# EAGLE design USB DigiVOX Interface V5 (EAGLE 9.6.1)
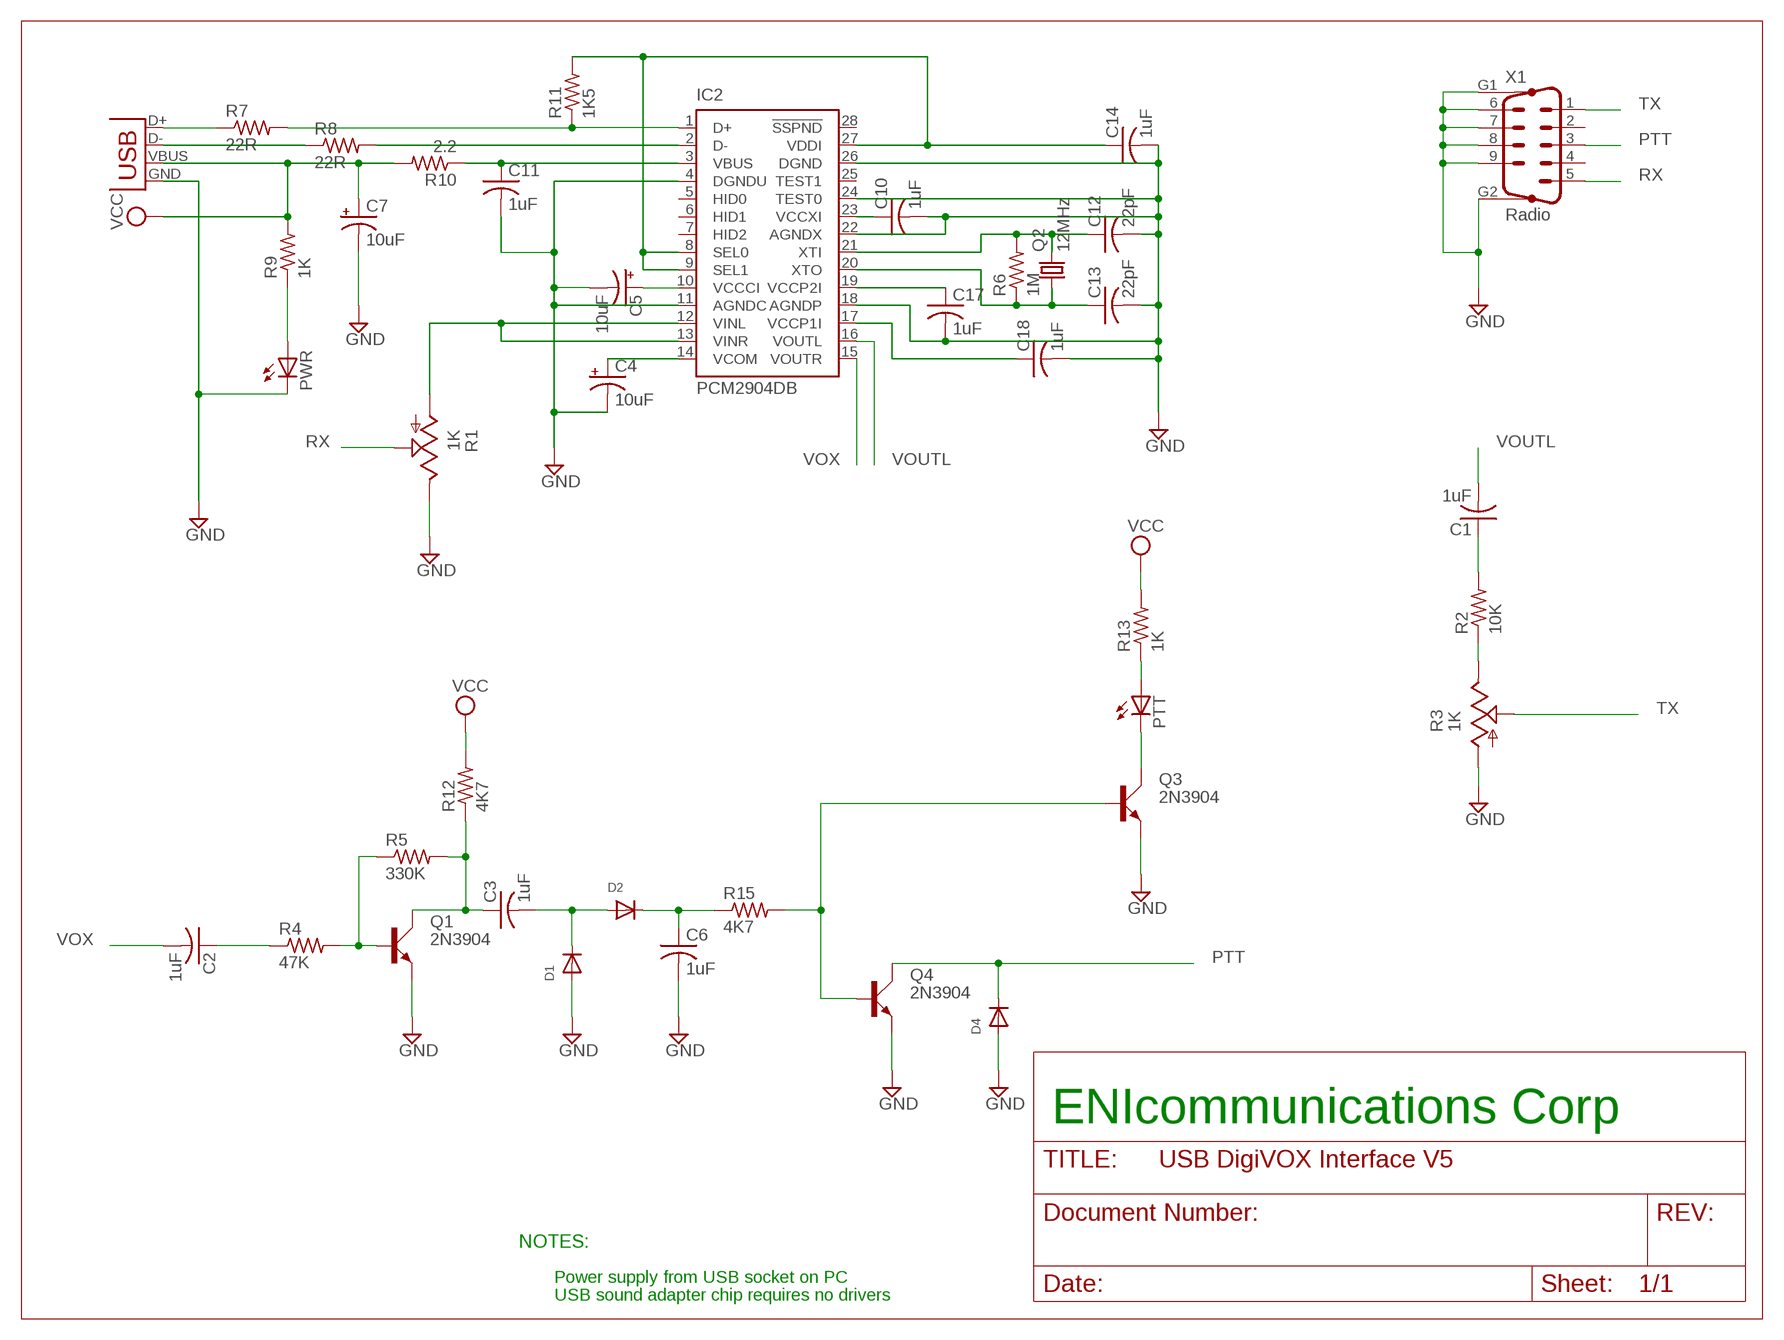
[diagram p0: schematic, sheet 1]

## Parts
C1  1uF  C-US025-025X050  [C025-025X050]
C2  1uF  C-US025-025X050  [C025-025X050]
C3  1uF  C-US025-025X050  [C025-025X050]
C4  10uF  CAP_POLPTH2  [CPOL-RADIAL-10UF-25V]
C5  10uF  CAP_POLPTH2  [CPOL-RADIAL-10UF-25V]
C6  1uF  C-US025-025X050  [C025-025X050]
C7  10uF  CAP_POLPTH2  [CPOL-RADIAL-10UF-25V]
C10  1uF  C-US025-025X050  [C025-025X050]
C11  1uF  C-US025-025X050  [C025-025X050]
C12  22pF  C-US025-025X050  [C025-025X050]
C13  22pF  C-US025-025X050  [C025-025X050]
C14  1uF  C-US025-025X050  [C025-025X050]
C17  1uF  C-US025-025X050  [C025-025X050]
C18  1uF  C-US025-025X050  [C025-025X050]
D1  DIODEDO-1N4148  [DO-1N4148]
D2  DIODEDO-1N4148  [DO-1N4148]
D4  DIODEDO-1N4148  [DO-1N4148]
IC2  PCM2904DB  [SSOP28DB]
PTT  LED3MM  [LED3MM]
PWR  LED3MM  [LED3MM]
Q1  2N3904  [TO92D]
Q2  12MHz  CRYSTALHC49S  [HC49/S]
Q3  2N3904  [TO92D]
Q4  2N3904  [TO92D]
R1  1K  TRIM_US-CA6V  [CA6V]
R2  10K  R-US_0204/7  [0204/7]
R3  1K  TRIM_US-CA6V  [CA6V]
R4  47K  R-US_0207/2V  [0207/2V]
R5  330K  R-US_0207/2V  [0207/2V]
R6  1M  R-US_0207/2V  [0207/2V]
R7  22R  R-US_0207/2V  [0207/2V]
R8  22R  R-US_0207/2V  [0207/2V]
R9  1K  R-US_0207/2V  [0207/2V]
R10  2.2  R-US_0207/2V  [0207/2V]
R11  1K5  R-US_0207/2V  [0207/2V]
R12  4K7  R-US_0207/2V  [0207/2V]
R13  1K  R-US_0204/7  [0204/7]
R15  4K7  R-US_0207/2V  [0207/2V]
X1  Radio  M09HP  [M09HP]
X2  USBSMD  [USB-MINIB]

## Nets
GND: C4.2(-) C5.2(-) C6.2 C7.2(-) C10.2 C11.2 C12.2 C13.2 C14.2 C17.2 C18.2 D1.A D4.A IC2.4(DGNDU) IC2.11(AGNDC) IC2.18(AGNDP) IC2.22(AGNDX) IC2.24(TEST0) IC2.26(DGND) PWR.K(C) Q1.E Q3.E Q4.E R1.E R3.A X1.6 X1.7 X1.8 X1.9 X1.G1 X1.G2 X2.GND
N$1: C1.1 R2.2
N$2: R2.1 R3.E
N$3: C5.1(+) IC2.10(VCCCI)
N$4: C12.1 IC2.21(XTI) Q2.2 R6.2
N$5: PWR.A R9.1
N$6: C13.1 IC2.20(XTO) Q2.1 R6.1
N$7: C10.1 IC2.23(VCCXI)
N$8: C2.1 R4.1
N$9: C4.1(+) IC2.14(VCOM)
N$10: Q1.B R4.2 R5.1
N$11: C3.1 Q1.C R5.2 R12.1
N$12: C3.2 D1.C D2.A
N$13: C14.1 IC2.8(SEL0) IC2.9(SEL1) IC2.27(VDDI) R11.2
N$14: C6.1 D2.C R15.1
N$15: C11.1 IC2.3(VBUS) R10.1
N$16: Q3.B Q4.B R15.2
N$17: R7.1 X2.D+
N$18: C17.1 IC2.19(VCCP2I)
N$19: IC2.1(D+) R7.2 R11.1
N$20: IC2.2(D-) R8.2
N$21: PTT.K(C) Q3.C
N$22: R8.1 X2.D-
N$23: PTT.A R13.1
N$26: C18.1 IC2.17(VCCP1I)
PTT: D4.C Q4.C X1.3
RX: R1.S X1.5
TX: R3.S X1.1
VCC: C7.1(+) R9.2 R10.2 R12.2 R13.2 X2.VBUS
VINL: IC2.12(VINL) IC2.13(VINR) R1.A
VOUTL: C1.2 IC2.16(VOUTL)
VOX: C2.2 IC2.15(VOUTR)
Unconnected: IC2.5(HID0) IC2.6(HID1) IC2.7(HID2) IC2.25(TEST1) IC2.28(!SSPND) X1.2 X1.4

## Notes on the sheet
- ENIcommunications Corp
- NOTES:
- Power supply from USB socket on PC
- USB sound adapter chip requires no drivers

## Library data of the parts
C1-C3 C6 C10-C14 C17 C18 = rcl:C-US: CAPACITOR, American symbol
C4 C5 C7 = SparkFun:CAP_POL: Capacitor Polarized These are standard SMD and PTH capacitors. Normally 10uF, 47uF, and 100uF in electrolytic and tantalum varieties. Always verify the external diameter of the through hole cap, it varies with capacity, voltage, and manufacturer. The EIA devices should be standard.
D1 D2 D4 = adafruit:DIODE: Diode SMADIODE - SMA Surface Mount Package 20V 1A Schottky Diode Digikey: 641-1014-6-ND DO-1N4148 - Through Hole Small Current Diode SOD-123 20V 1 A (.5mV Vf) Schottky Diode - Digikey: MBRX120TPMSCT-ND SOD-323 10V 570mA (.38mV Vf, 3ns) Schottky Diode - Digikey: ZLLS410CT-ND SOD-523 30V 30mA Schottky Diode (RB751S-40TE61) - Digikey: RB751S-40TE61CT-ND SOT23-R/W - SOT23 Package (R = Solder Paste/Reflow Ovens, W = Hand-Soldering) BAT54Film 40V 300mA - Digikey: 497-7162-1-ND
IC2 = texas:PCM29*: STEREO AUDIO CODEC WITH USB INTERFACE SINGLE-ENDED ANALOG INPUT/OUTPUT AND S/PDIF
PTT PWR = led:LED: LED OSRAM: - CHIPLED LG R971, LG N971, LY N971, LG Q971, LY Q971, LO R971, LY R971 LH N974, LH R974 LS Q976, LO Q976, LY Q976 LO Q996 - Hyper CHIPLED LW Q18S LB Q993, LB Q99A, LB R99A - SideLED LS A670, LO A670, LY A670, LG A670, LP A670 LB A673, LV A673, LT A673, LW A673 LH A674 LY A675 LS A676, LA A676, LO A676, LY A676, LW A676 LS A679, LY A679, LG A679 - Hyper Micro SIDELED® LS Y876, LA Y876, LO Y876, LY Y876 LT Y87S - SmartLED LW L88C, LW L88S LB L89C, LB L89S, LG L890 LS L89K, LO L89K, LY L89K LS L896, LA L896, LO L896, LY L896 - TOPLED LS T670, LO T670, LY T670, LG T670, LP T670 LSG T670, LSP T670, LSY T670, LOP T670, LYG T670 LG T671, LOG T671, LSG T671 LB T673, LV T673, LT T673, LW T673 LH T674 LS T676, LA T676, LO T676, LY T676, LB T676, LH T676, LSB T676, LW T676 LB T67C, LV T67C, LT T67C, LS T67K, LO T67K, LY T67K, LW E67C LS E67B, LA E67B, LO E67B, LY E67B, LB E67C, LV E67C, LT E67C LW T67C LS T679, LY T679, LG T679 LS T770, LO T770, LY T770, LG T770, LP T770 LB T773, LV T773, LT T773, LW T773 LH T774 LS E675, LA E675, LY E675, LS T675 LS T776, LA T776, LO T776, LY T776, LB T776 LHGB T686 LT T68C, LB T68C - Hyper Mini TOPLED® LB M676 - Mini TOPLED Santana® LG M470 LS M47K, LO M47K, LY M47K Source: http://www.osram.convergy.de LUXEON: - LUMILED® LXK2-PW12-R00, LXK2-PW12-S00, LXK2-PW14-U00, LXK2-PW14-V00 LXK2-PM12-R00, LXK2-PM12-S00, LXK2-PM14-U00 LXK2-PE12-Q00, LXK2-PE12-R00, LXK2-PE12-S00, LXK2-PE14-T00, LXK2-PE14-U00 LXK2-PB12-K00, LXK2-PB12-L00, LXK2-PB12-M00, LXK2-PB14-N00, LXK2-PB14-P00, LXK2-PB14-Q00 LXK2-PR12-L00, LXK2-PR12-M00, LXK2-PR14-Q00, LXK2-PR14-R00 LXK2-PD12-Q00, LXK2-PD12-R00, LXK2-PD12-S00 LXK2-PH12-R00, LXK2-PH12-S00 LXK2-PL12-P00, LXK2-PL12-Q00, LXK2-PL12-R00 Source: www.luxeon.com KINGBRIGHT: KA-3528ASYC Source: www.kingbright.com
Q1 Q3 Q4 = transistor-small-signal:2N3904: NPN TRANSISTOR
Q2 = crystal:CRYSTAL: CRYSTAL
R1 R3 = pot:TRIM_US-: POTENTIOMETER
R2 R4-R13 R15 = resistor:R-US_: RESISTOR, American symbol
X1 = con-subd:M09HP: SUB-D
X2 = SparkFun:USB: USB Connectors USB-B-PTH is fully proven SKU : PRT-00139 USB-miniB is fully proven SKU : PRT-00587 USB-A-PCB is untested. USB-A-H is throughly reviewed, but untested. Spark Fun Electronics SKU : PRT-00437 USB-B-SMT is throughly reviewed, but untested. Needs silkscreen touching up. USB-A-S has not been used/tested USB-MB-H has not been used/tested

## Board
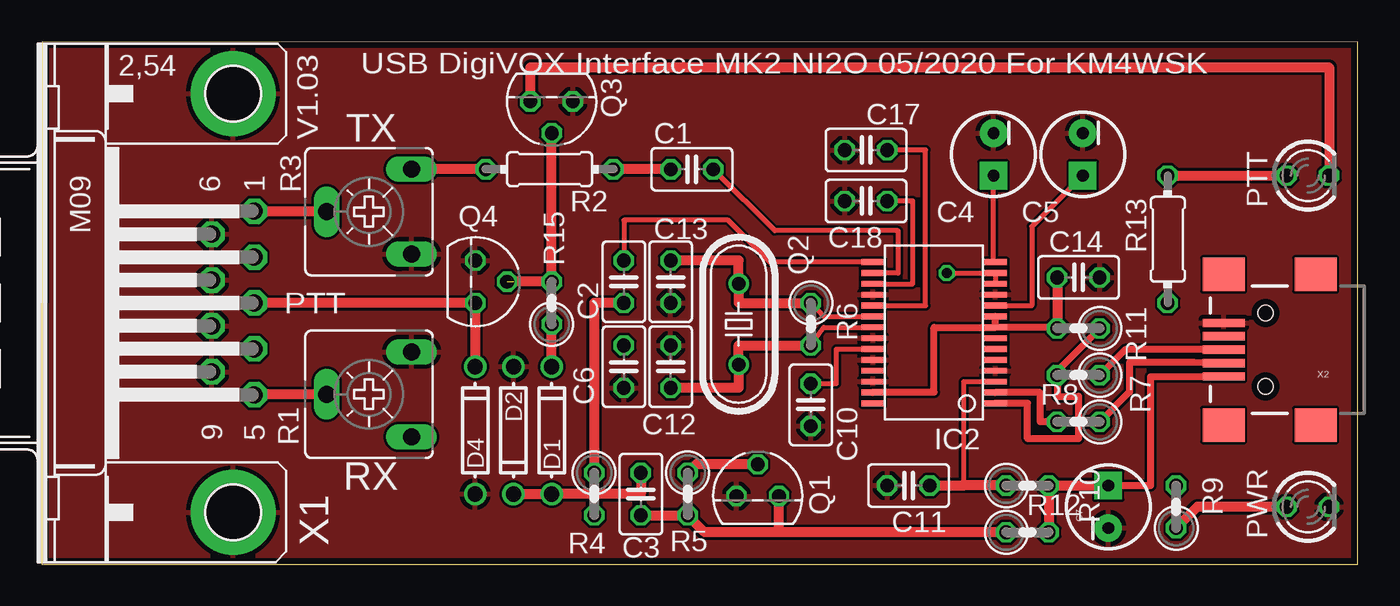
[diagram p1: board, top side]
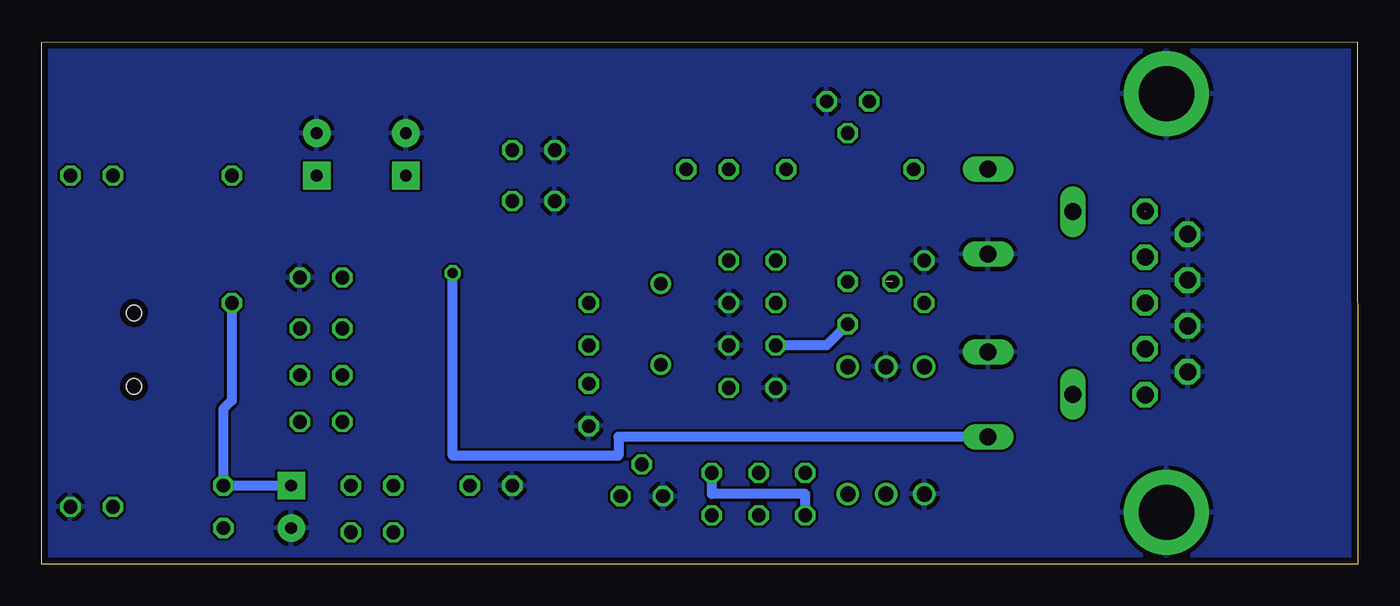
[diagram p2: board, bottom side, seen from below]

Size 78.66 x 31.24 mm. Coordinates in mm from the lower left corner, seen from the top.
Outline: 0,0 78.66,0 78.66,31.23 0.01,31.24 0,0
Copper layers (1*16): Top 0.0356mm / dielectric 1.5011mm / Bottom 0.0356mm
Design rules "LaenPCBOrder": minimum track width 10mil, minimum drill 13mil, track to track 6mil, track to pad 6mil, pad to pad 6mil, via to via 6mil, smd to smd 6mil, copper to edge 15mil, drill to drill 6mil, minimum pad ring 7mil, minimum via ring 7mil, stop-mask expansion 4mil, vias tented up to drill 0mil, thermal gap 10mil

### Footprints (pad centres in the part's own frame; a part is rotated, then mirrored left to right if it is on the bottom)
C025-025X050 = drill 0.813 octagon: 1 -1.27,0; 2 1.27,0
CPOL-RADIAL-10UF-25V = drill 0.7 pad 1.651 square: 1 1.27,0 | drill 0.7 pad 1.651: 2 -1.27,0
DO-1N4148 = drill 0.9: A -3.81,0; C 3.81,0
SSOP28DB = smd 0.348 x 1.397: 1 -4.225,-3.656; 2 -3.575,-3.656; 3 -2.925,-3.656; 4 -2.275,-3.656; 5 -1.625,-3.656; 6 -0.975,-3.656; 7 -0.325,-3.656; 8 0.325,-3.656; 9 0.975,-3.656; 10 1.625,-3.656; 11 2.275,-3.656; 12 2.925,-3.656; 13 3.575,-3.656; 14 4.225,-3.656; 15 4.225,3.656; 16 3.575,3.656; 17 2.925,3.656; 18 2.275,3.656; 19 1.625,3.656; 20 0.975,3.656; 21 0.325,3.656; 22 -0.325,3.656; 23 -0.975,3.656; 24 -1.625,3.656; 25 -2.275,3.656; 26 -2.925,3.656; 27 -3.575,3.656; 28 -4.225,3.656
LED3MM = drill 0.813 octagon: A -1.27,0; K 1.27,0
TO92D = drill 0.813 octagon: B 0,1.905; C 1.27,0; E -1.27,0
HC49/S = drill 0.813: 1 -2.413,0; 2 2.413,0
CA6V = drill 1.016 long: A -2.54,-2.54; E 2.54,-2.54; S 0,2.54
0204/7 = drill 0.813 octagon: 1 -3.81,0; 2 3.81,0
0207/2V = drill 0.813 octagon: 1 -1.27,0; 2 1.27,0
M09HP = drill 1.016 octagon: 1 -5.486,1.27; 2 -2.743,1.27; 3 0,1.27; 4 2.743,1.27; 5 5.486,1.27; 6 -4.115,-1.27; 7 -1.372,-1.27; 8 1.372,-1.27; 9 4.115,-1.27 | drill 3.302 pad 5.08: G1 -12.522,0; G2 12.522,0
USB-MINIB = smd 2.5 x 0.5: D+ 2.5,0; D- 2.5,0.8; GND 2.5,-1.6; ID 2.5,-0.8; VBUS 2.5,1.6 | smd 2.5 x 2: GND@1 -3,-4.5; GND@2 -3,4.5; GND@3 2.5,4.5; GND@4 2.5,-4.5 | hole 0.9: 0,2.2; 0,-2.2

### Placement (x,y rotation side)
C1  38.86,23.62 0 top
C2  34.8,16.89 90 top
C3  35.81,4.19 90 top
C4  56.9,24.51 270 top
C5  62.23,24.51 270 top
C6  34.8,11.81 270 top
C7  63.75,3.43 90 top
C10  45.97,9.53 270 top
C11  51.82,4.7 180 top
C12  37.59,11.81 90 top
C13  37.59,16.89 270 top
C14  61.98,17.14 0 top
C17  49.28,24.77 180 top
C18  49.28,21.72 180 top
D1  28.19,8 270 top
D2  30.48,8 90 top
D4  25.91,8 90 top
IC2  53.34,13.84 90 top
PTT  75.69,23.24 0 top
PWR  75.69,3.43 0 top
Q1  42.8,4.06 0 top
Q2  41.66,14.35 270 top
Q3  30.48,27.69 180 top
Q4  25.91,16.89 270 top
R1  19.56,10.16 90 top
R2  30.35,23.62 0 top
R3  19.56,21.08 90 top
R4  33.02,4.19 270 top
R5  38.61,4.19 270 top
R6  45.97,14.35 270 top
R7  61.98,11.3 180 top
R8  61.98,8.51 180 top
R9  67.82,3.43 90 top
R10  58.93,4.7 0 top
R11  61.98,14.1 180 top
R12  58.93,1.91 0 top
R13  67.31,19.43 270 top
R15  30.48,15.62 90 top
X1  11.43,15.62 270 top
X2  73.15,12.83 180 top

### Tracks (layer width: path | path; a pad name or v marks a point on that pad's centre or on a via)
GND
  pour Bottom: 0,0 78.74,0 78.74,31.24 0,31.24
  pour Top: 0,0 78.74,0 78.74,31.24 0,31.24
N$1
  Top 0.61: C1.1 R2.2
N$2
  Top 0.61: R2.1 R3.E
N$3
  Top 0.305: IC2.10 59.18,15.47 59.18,20.19 C5.1
N$4
  Top 0.305: R6.2 46.74,14.17 IC2.21
  Top 0.61: C12.1 41.66,10.54 Q2.2 41.66,13.08 R6.2
N$5
  Top 0.61: PWR.A 69.09,3.43 R9.1
N$6
  Top 0.305: R6.1 46.74,14.82 IC2.20
  Top 0.61: C13.1 41.66,18.16 Q2.1 41.66,15.62 R6.1
N$7
  Top 0.305: C10.1 47.5,10.79 47.5,12.87 IC2.23
N$8
  Top 0.61: C2.1 33.02,15.62 R4.1
N$9
  Top 0.305: 57.15,18.07 IC2.14 56.9,18.07 C4.1
N$10
  Top 0.61: Q1.B 39.12,5.97 R5.1
  Bottom 0.61: R4.2 33.02,4.19 38.61,4.19 R5.1
N$11
  Top 0.61: 44.07,1.91 39.62,1.91 R5.2 C3.1 | R12.1 44.07,1.91 | 44.07,1.91 Q1.C
N$12
  Top 0.61: D1.C D2.A 35.81,4.19 C3.2
N$13
  Top 0.406: R11.2 60.71,14.17 IC2.8 | IC2.8 IC2.9 | IC2.27 49.68,10.29 53.34,10.29 53.34,14.17 IC2.8
  Top 0.61: C14.1 R11.2
N$14
  Top 0.61: D2.C R15.1
  Bottom 0.61: R15.1 31.75,13.08 C6.1
N$15
  Top 0.305: 55.12,4.7 55.12,10.92 IC2.3
  Top 0.61: R10.1 55.12,4.7 C11.1
N$16  (1 unrouted)
  Top 0.61: 28.19,16.89 R15.2 Q3.B
N$17
  Top 0.406: X2.D+ 64.77,12.83 R7.1
N$18
  Top 0.305: IC2.19 52.83,15.47 52.83,24.77 C17.1
N$19
  Top 0.406: IC2.1 58.93,9.62 58.93,7.49 61.98,7.49 61.98,10.03 60.71,10.03 R7.2 60.71,11.56 R11.1
N$20
  Top 0.406: R8.2 59.69,8.51 59.69,10.27 IC2.2
N$21
  Top 0.61: Q3.C 29.21,29.72 76.96,29.72 PTT.K
N$22
  Top 0.406: X2.D- 68.87,12.06 65.02,12.06 65.02,10.29 R8.1
N$23
  Top 0.61: R13.1 PTT.A
N$26
  Top 0.305: IC2.17 52.07,16.77 52.07,21.72 C18.1
PTT
  Top 0.61: X1.3 Q4.C D4.C
RX
  Top 0.305: 12.7,10.16 12.72,10.16 X1.5
  Top 0.61: R1.S 12.7,10.16
TX  (1 unrouted)
  Top 0.61: R3.S 12.7,21.08
VCC
  Top 0.406: C7.1 66.29,4.7 66.29,11.23 X2.VBUS
  Top 0.61: C7.1 R10.2 R12.2
  Bottom 0.305: 66.04,4.7 C7.1
  Bottom 0.61: C7.1 R9.2 67.82,9.27 67.31,9.78 R13.2
VINL  (via drill 0.6)
  Top 0.305: v54.1,17.4 57,17.4 IC2.13 IC2.12
  Bottom 0.61: R1.A 44.2,7.62 44.2,6.48 54.1,6.48 v54.1,17.4
VOUTL
  Top 0.305: C1.2 43.81,19.94 51.18,19.94 51.18,17.4 49.68,17.4 IC2.16
VOX
  Top 0.305: IC2.15 43.53,18.07 41.02,20.57 34.8,20.57 C2.2

### Text on the board
tSilk: USB DigiVOX Interface MK2 NI2O 05/2020 For KM4WSK | V1.03 | TX | PTT | RX